# EAGLE design ts6907 (EAGLE 6.6.0)

## Sheet 1 of 2
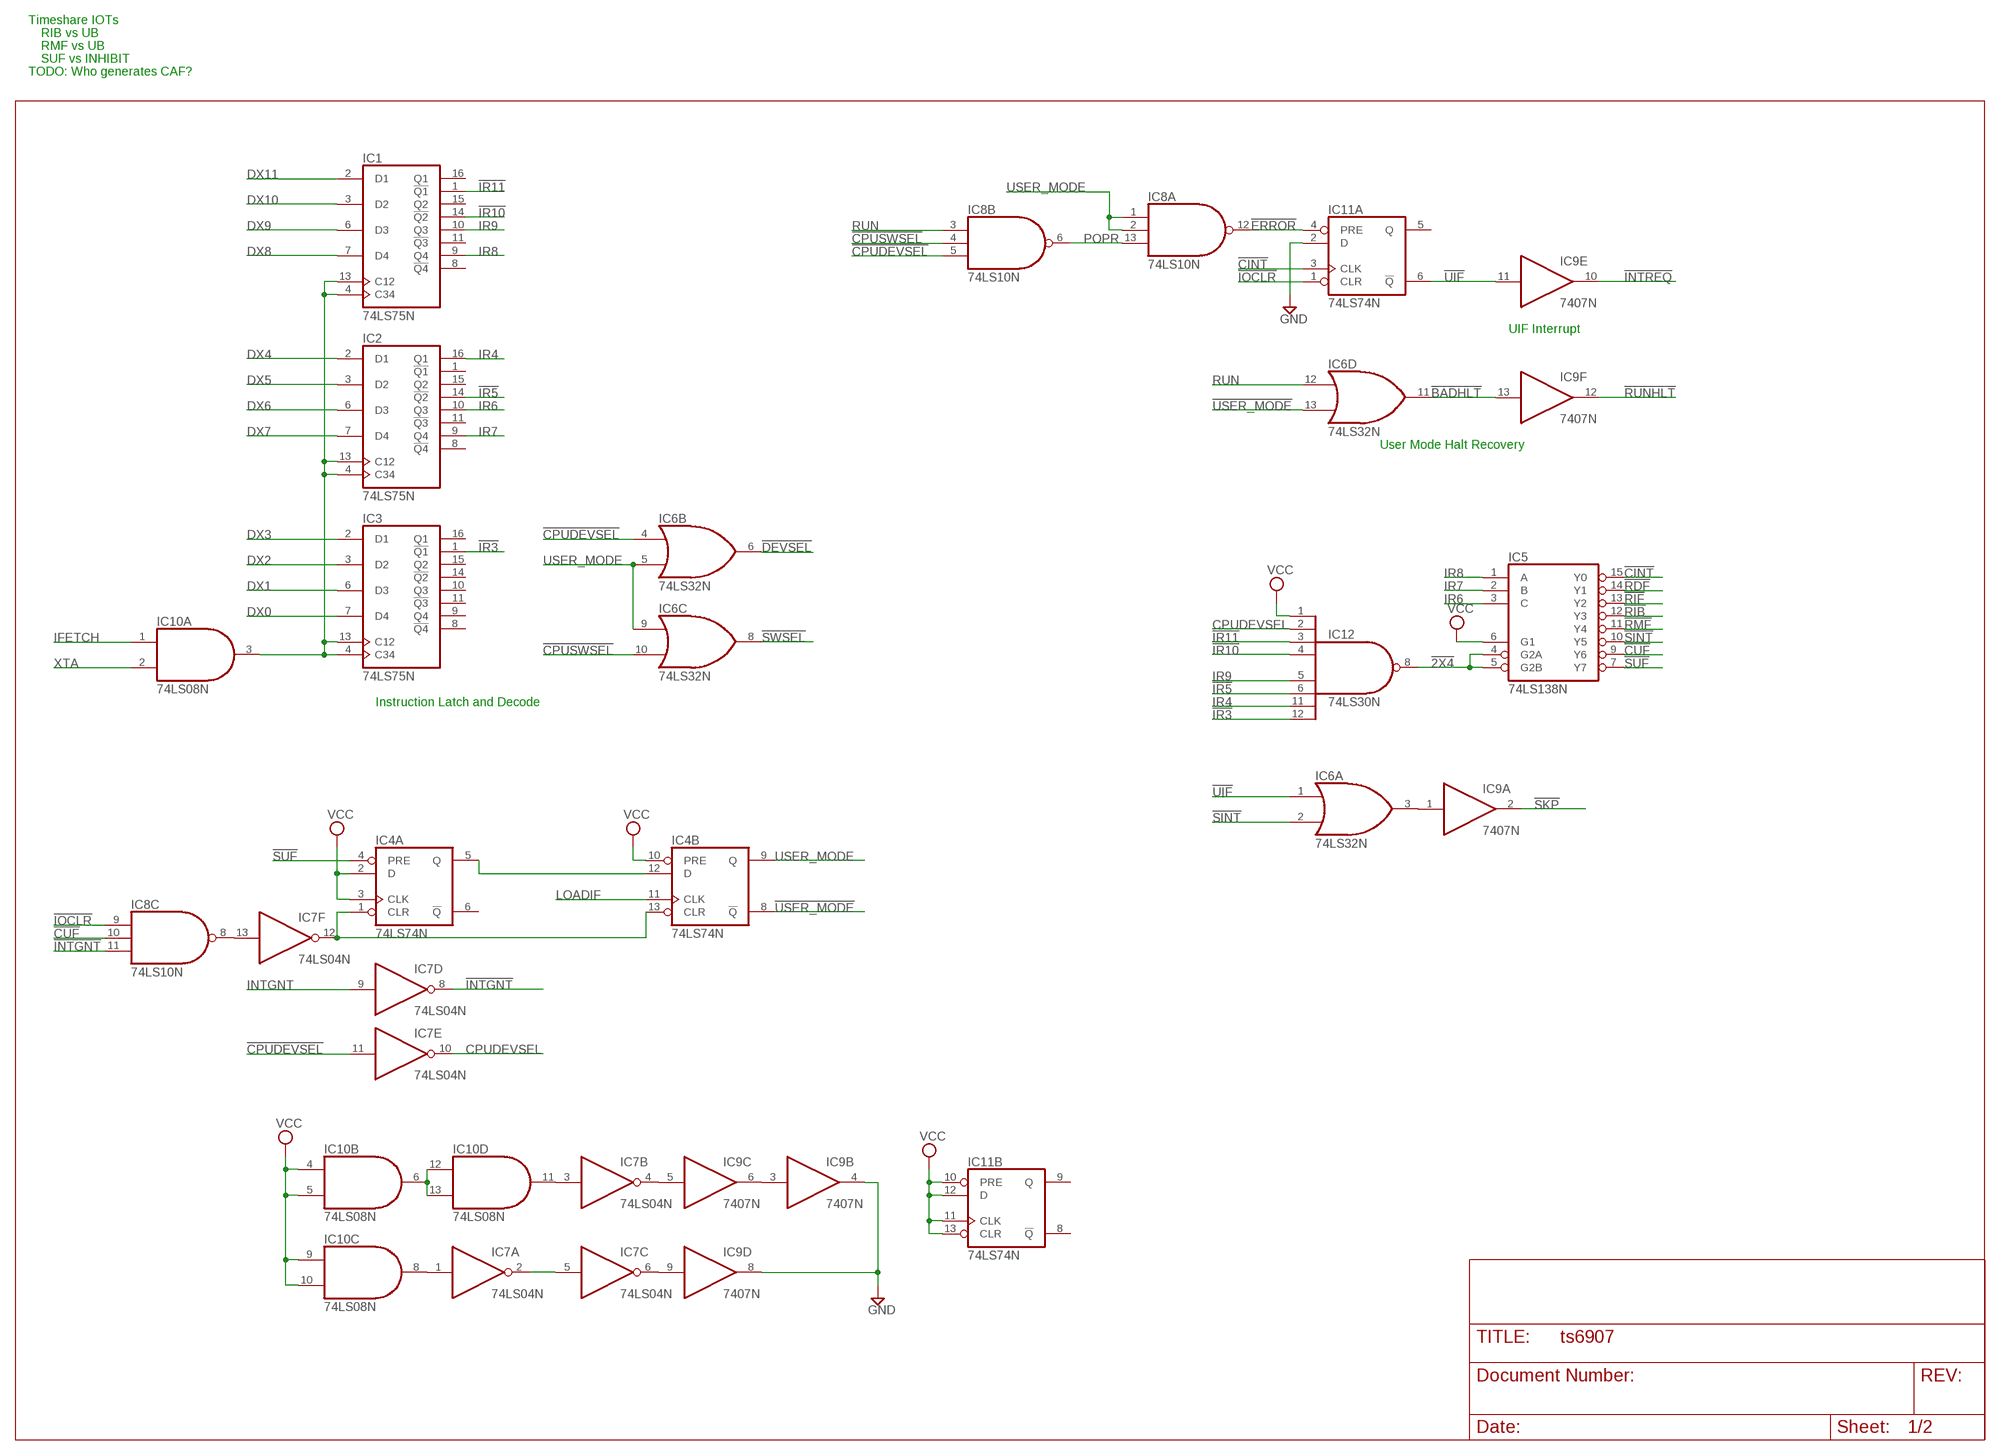
[diagram p0: schematic, sheet 1]

### Parts
IC1  74LS75N  [DIL16]
IC2  74LS75N  [DIL16]
IC3  74LS75N  [DIL16]
IC4  74LS74N  [DIL14]
IC5  74LS138N  [DIL16]
IC6  74LS32N  [DIL14]
IC7  74LS04N  [DIL14]
IC8  74LS10N  [DIL14]
IC9  7407N  [DIL14]
IC10  74LS08N  [DIL14]
IC11  74LS74N  [DIL14]
IC12  74LS30N  [DIL14]

### Nets
!2X4: IC5.4(G2A) IC5.5(G2B) IC12.8(O)
!BADHLT: IC6.11(D:O) IC9.13(F:I)
!CINT: IC5.15(Y0) IC11.3(A:CLK)
!CPUDEVSEL: IC6.4(B:I0) IC7.11(E:I) IC8.5(B:I2) ; also sheet 2
!CPUSWSEL: IC6.10(C:I1) IC8.4(B:I1) ; also sheet 2
!CUF: IC5.9(Y6) IC8.10(C:I1)
!DEVSEL: IC6.6(B:O) ; also sheet 2
!ERROR: IC8.12(A:O) IC11.4(A:PRE)
!INTGNT: IC7.8(D:O) IC8.11(C:I2)
!INTREQ: IC9.10(E:O) ; also sheet 2
!IOCLR: IC8.9(C:I0) IC11.1(A:CLR) ; also sheet 2
!IR3: IC3.1(!Q1) IC12.12(I7)
!IR5: IC2.14(!Q2) IC12.6(I5)
!IR10: IC1.14(!Q2) IC12.4(I3)
!IR11: IC1.1(!Q1) IC12.3(I2)
!RDF: IC5.14(Y1)
!RIB: IC5.12(Y3)
!RIF: IC5.13(Y2)
!RMF: IC5.11(Y4)
!RUNHLT: IC9.12(F:O) ; also sheet 2
!SINT: IC5.10(Y5) IC6.2(A:I1)
!SKP: IC9.2(A:O) ; also sheet 2
!SUF: IC4.4(A:PRE) IC5.7(Y7)
!SWSEL: IC6.8(C:O) ; also sheet 2
!UIF: IC6.1(A:I0) IC9.11(E:I) IC11.6(A:!Q)
!USER_MODE: IC4.8(B:!Q) IC6.13(D:I1)
CPUDEVSEL: IC7.10(E:O) IC12.2(I1)
DX0: IC3.7(D4) ; also sheet 2
DX1: IC3.6(D3) ; also sheet 2
DX2: IC3.3(D2) ; also sheet 2
DX3: IC3.2(D1) ; also sheet 2
DX4: IC2.2(D1) ; also sheet 2
DX5: IC2.3(D2) ; also sheet 2
DX6: IC2.6(D3) ; also sheet 2
DX7: IC2.7(D4) ; also sheet 2
DX8: IC1.7(D4) ; also sheet 2
DX9: IC1.6(D3) ; also sheet 2
DX10: IC1.3(D2) ; also sheet 2
DX11: IC1.2(D1) ; also sheet 2
GND: IC9.4(B:O) IC9.8(D:O) IC11.2(A:D) ; also sheet 2
IFETCH: IC10.1(A:I0) ; also sheet 2
INTGNT: IC7.9(D:I) ; also sheet 2
IR4: IC2.16(Q1) IC12.11(I6)
IR6: IC2.10(Q3) IC5.3(C)
IR7: IC2.9(Q4) IC5.2(B)
IR8: IC1.9(Q4) IC5.1(A)
IR9: IC1.10(Q3) IC12.5(I4)
LOADIF: IC4.11(B:CLK) ; also sheet 2
N$1: IC4.5(A:Q) IC4.12(B:D)
N$2: IC7.1(A:I) IC10.8(C:O)
N$3: IC1.4(C34) IC1.13(C12) IC2.4(C34) IC2.13(C12) IC3.4(C34) IC3.13(C12) IC10.3(A:O)
N$4: IC4.1(A:CLR) IC4.13(B:CLR) IC7.12(F:O)
N$5: IC7.3(B:I) IC10.11(D:O)
N$6: IC7.2(A:O) IC7.5(C:I)
N$7: IC10.6(B:O) IC10.12(D:I0) IC10.13(D:I1)
N$8: IC7.4(B:O) IC9.5(C:I)
N$9: IC7.6(C:O) IC9.9(D:I)
N$10: IC9.3(B:I) IC9.6(C:O)
N$11: IC6.3(A:O) IC9.1(A:I)
N$12: IC7.13(F:I) IC8.8(C:O)
POPR: IC8.6(B:O) IC8.13(A:I2)
RUN: IC6.12(D:I0) IC8.3(B:I0) ; also sheet 2
USER_MODE: IC4.9(B:Q) IC6.5(B:I1) IC6.9(C:I0) IC8.1(A:I0) IC8.2(A:I1)
VCC: IC4.2(A:D) IC4.3(A:CLK) IC4.10(B:PRE) IC5.6(G1) IC10.4(B:I0) IC10.5(B:I1) IC10.9(C:I0) IC10.10(C:I1) IC11.10(B:PRE) IC11.11(B:CLK) IC11.12(B:D) IC11.13(B:CLR) IC12.1(I0) ; also sheet 2
XTA: IC10.2(A:I1) ; also sheet 2
Unconnected: IC1.8(!Q4) IC1.11(!Q3) IC1.15(Q2) IC1.16(Q1) IC2.1(!Q1) IC2.8(!Q4) IC2.11(!Q3) IC2.15(Q2) IC3.8(!Q4) IC3.9(Q4) IC3.10(Q3) IC3.11(!Q3) IC3.14(!Q2) IC3.15(Q2) IC3.16(Q1) IC4.6(A:!Q) IC11.5(A:Q) IC11.8(B:!Q) IC11.9(B:Q)

### Notes on the sheet
- Timeshare IOTs
- RIB vs UB
- RMF vs UB
- SUF vs INHIBIT
- TODO: Who generates CAF?
- UIF Interrupt
- User Mode Halt Recovery
- Instruction Latch and Decode

## Sheet 2 of 2
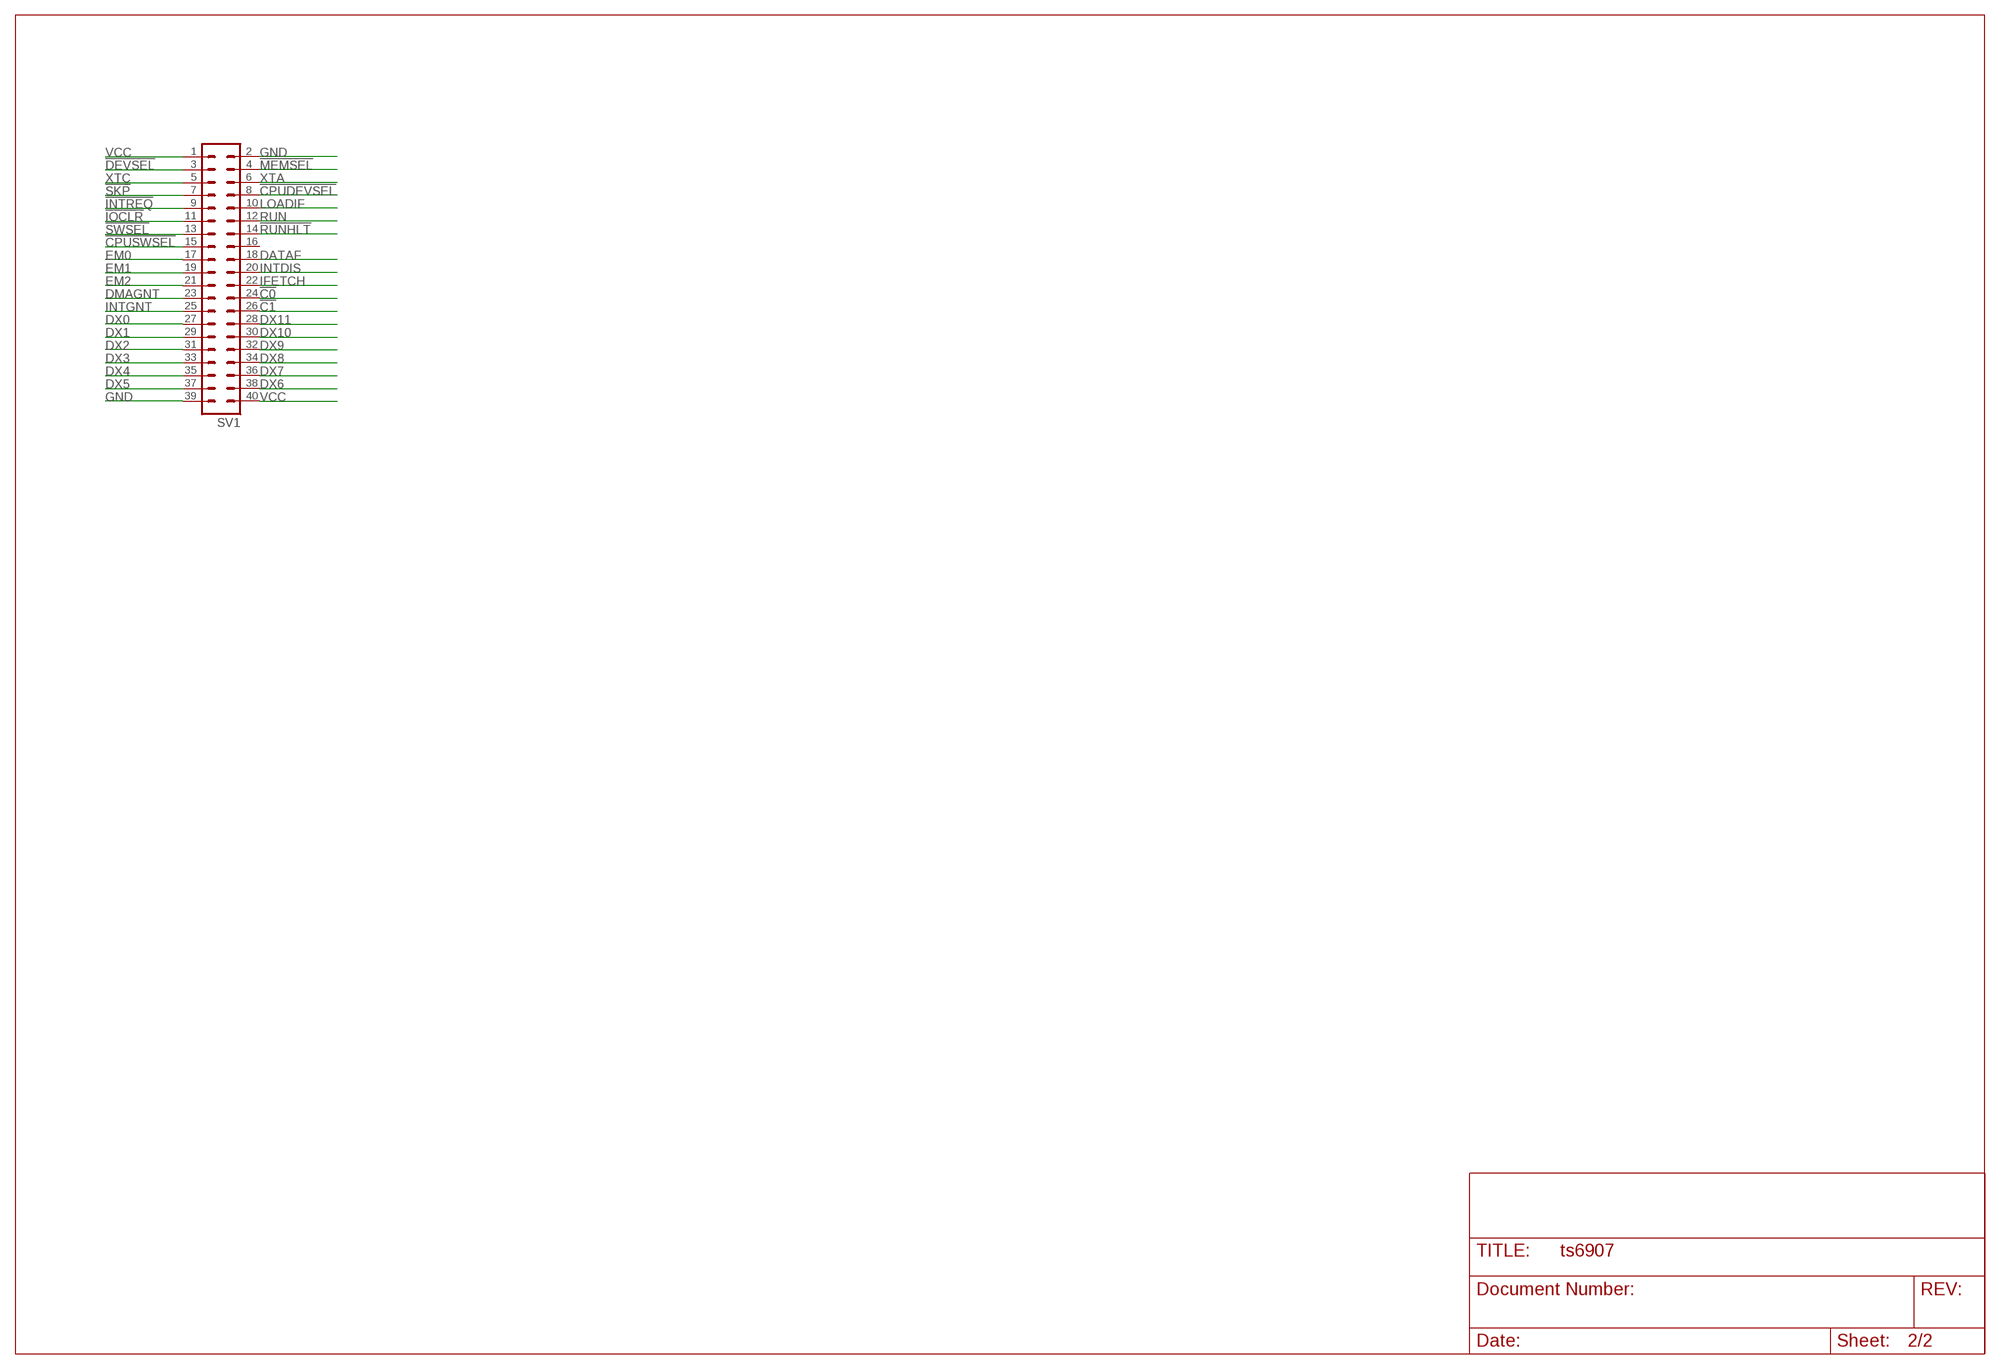
[diagram p1: schematic, sheet 2]

### Parts
SV1  MA20-2  [MA20-2]

### Nets
!C0: SV1.24
!C1: SV1.26
!CPUDEVSEL: SV1.8 ; also sheet 1
!CPUSWSEL: SV1.15 ; also sheet 1
!DEVSEL: SV1.3 ; also sheet 1
!INTREQ: SV1.9 ; also sheet 1
!IOCLR: SV1.11 ; also sheet 1
!MEMSEL: SV1.4
!RUNHLT: SV1.14 ; also sheet 1
!SKP: SV1.7 ; also sheet 1
!SWSEL: SV1.13 ; also sheet 1
DATAF: SV1.18
DMAGNT: SV1.23
DX0: SV1.27 ; also sheet 1
DX1: SV1.29 ; also sheet 1
DX2: SV1.31 ; also sheet 1
DX3: SV1.33 ; also sheet 1
DX4: SV1.35 ; also sheet 1
DX5: SV1.37 ; also sheet 1
DX6: SV1.38 ; also sheet 1
DX7: SV1.36 ; also sheet 1
DX8: SV1.34 ; also sheet 1
DX9: SV1.32 ; also sheet 1
DX10: SV1.30 ; also sheet 1
DX11: SV1.28 ; also sheet 1
EM0: SV1.17
EM1: SV1.19
EM2: SV1.21
GND: SV1.2 SV1.39 ; also sheet 1
IFETCH: SV1.22 ; also sheet 1
INTDIS: SV1.20
INTGNT: SV1.25 ; also sheet 1
LOADIF: SV1.10 ; also sheet 1
RUN: SV1.12 ; also sheet 1
VCC: SV1.1 SV1.40 ; also sheet 1
XTA: SV1.6 ; also sheet 1
XTC: SV1.5
Unconnected: SV1.16

## Power pins joined to a net without a drawn wire
GND: IC1.12(GND) IC2.12(GND) IC3.12(GND) IC4.7(P:GND) IC5.8(GND) IC6.7(P:GND) IC7.7(P:GND) IC8.7(P:GND) IC9.7(P:GND) IC10.7(P:GND) IC11.7(P:GND) IC12.7(GND)
VCC: IC1.5(VCC) IC2.5(VCC) IC3.5(VCC) IC4.14(P:VCC) IC5.16(VCC) IC6.14(P:VCC) IC7.14(P:VCC) IC8.14(P:VCC) IC9.14(P:VCC) IC10.14(P:VCC) IC11.14(P:VCC) IC12.14(VCC)

## Library data of the parts
IC1-IC3 = 74xx-us:74*75: 4-bit bistable LATCH
IC4 IC11 = 74xx-us:74*74: Dual D type positive edge triggered FLIP FLOP, preset and clear
IC5 = 74xx-us:74*138: 3-line to 8-line DECODER/DEMULTIPLEXER
IC6 = 74xx-us:74*32: Quad 2-input OR gate
IC7 = 74xx-us:74*04: Hex INVERTER
IC8 = 74xx-us:74*10: Triple 3-input NAND gate
IC9 = 74xx-us:74*07: Hex BUFFER, open collector high-voltage output
IC10 = 74xx-us:74*08: Quad 2-input AND gate
IC12 = 74xx-us:74*30: 8-input NAND gate
SV1 = con-lstb:MA20-2: PIN HEADER; OC_FARNELL: unknown; OC_NEWARK: unknown

## Board
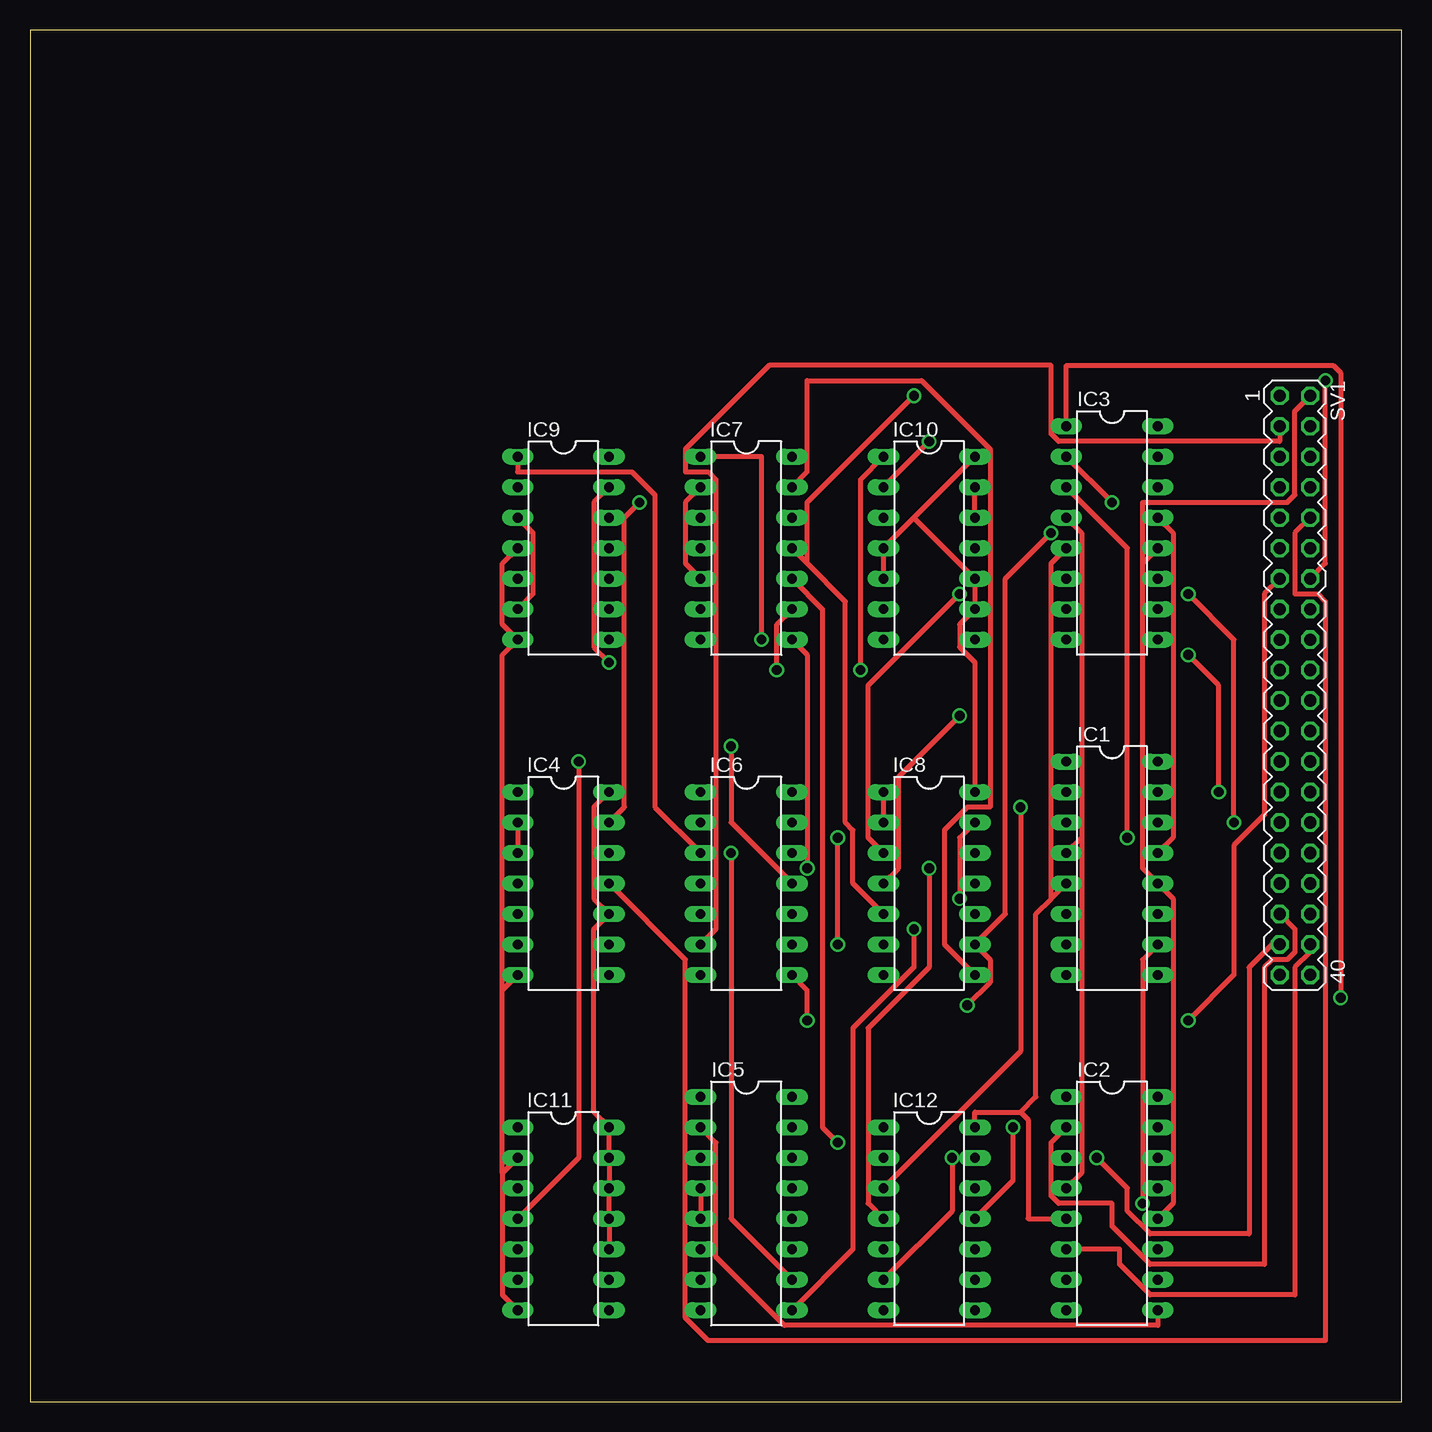
[diagram p2: board, top side]
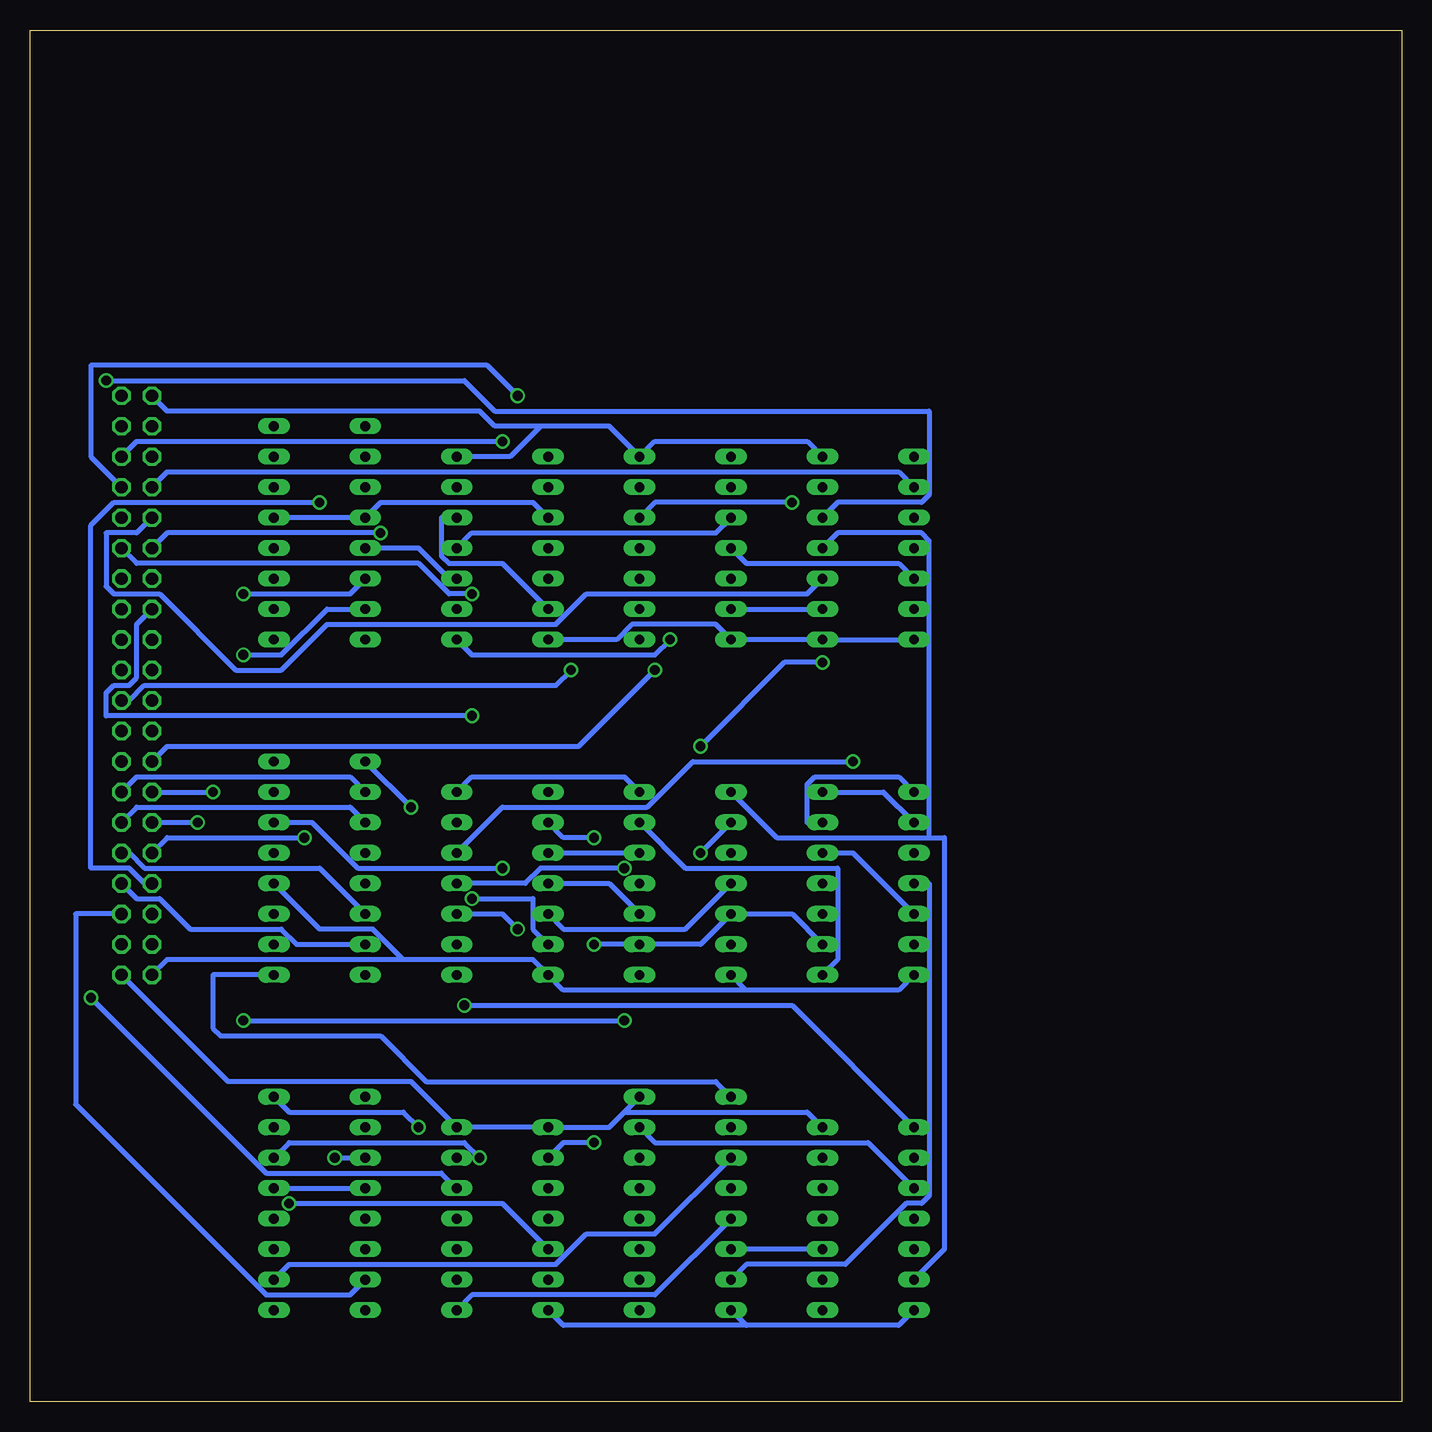
[diagram p3: board, bottom side, seen from below]

Size 114.3 x 114.3 mm. Coordinates in mm from the lower left corner, seen from the top.
Outline: 0,0 114.3,0 114.3,114.3 0,114.3 0,0
Copper layers (1+16): Top 0.035mm / dielectric 1.5mm / Bottom 0.035mm
Design rules "16mils": minimum track width 16mil, minimum drill 32mil, track to track 15mil, track to pad 10mil, pad to pad 10mil, via to via 10mil, smd to smd 10mil, copper to edge 13mil, drill to drill 10mil, minimum pad ring 10mil, minimum via ring 8mil, stop-mask expansion 0mil, vias tented up to drill 0mil, thermal gap 10mil

### Footprints (pad centres in the part's own frame; a part is rotated, then mirrored left to right if it is on the bottom)
DIL16 = drill 0.813 long: 1 -8.89,-3.81; 2 -6.35,-3.81; 3 -3.81,-3.81; 4 -1.27,-3.81; 5 1.27,-3.81; 6 3.81,-3.81; 7 6.35,-3.81; 8 8.89,-3.81; 9 8.89,3.81; 10 6.35,3.81; 11 3.81,3.81; 12 1.27,3.81; 13 -1.27,3.81; 14 -3.81,3.81; 15 -6.35,3.81; 16 -8.89,3.81
DIL14 = drill 0.813 long: 1 -7.62,-3.81; 2 -5.08,-3.81; 3 -2.54,-3.81; 4 0,-3.81; 5 2.54,-3.81; 6 5.08,-3.81; 7 7.62,-3.81; 8 7.62,3.81; 9 5.08,3.81; 10 2.54,3.81; 11 0,3.81; 12 -2.54,3.81; 13 -5.08,3.81; 14 -7.62,3.81
MA20-2 = drill 1.016 octagon: 1 -24.13,-1.27; 2 -24.13,1.27; 3 -21.59,-1.27; 4 -21.59,1.27; 5 -19.05,-1.27; 6 -19.05,1.27; 7 -16.51,-1.27; 8 -16.51,1.27; 9 -13.97,-1.27; 10 -13.97,1.27; 11 -11.43,-1.27; 12 -11.43,1.27; 13 -8.89,-1.27; 14 -8.89,1.27; 15 -6.35,-1.27; 16 -6.35,1.27; 17 -3.81,-1.27; 18 -3.81,1.27; 19 -1.27,-1.27; 20 -1.27,1.27; 21 1.27,-1.27; 22 1.27,1.27; 23 3.81,-1.27; 24 3.81,1.27; 25 6.35,-1.27; 26 6.35,1.27; 27 8.89,-1.27; 28 8.89,1.27; 29 11.43,-1.27; 30 11.43,1.27; 31 13.97,-1.27; 32 13.97,1.27; 33 16.51,-1.27; 34 16.51,1.27; 35 19.05,-1.27; 36 19.05,1.27; 37 21.59,-1.27; 38 21.59,1.27; 39 24.13,-1.27; 40 24.13,1.27

### Placement (x,y rotation side)
IC1  90.17,44.45 270 top
IC2  90.17,16.51 270 top
IC3  90.17,72.39 270 top
IC4  44.45,43.18 270 top
IC5  59.69,16.51 270 top
IC6  59.69,43.18 270 top
IC7  59.69,71.12 270 top
IC8  74.93,43.18 270 top
IC9  44.45,71.12 270 top
IC10  74.93,71.12 270 top
IC11  44.45,15.24 270 top
IC12  74.93,15.24 270 top
SV1  105.41,59.69 270 top

### Tracks (layer width: path | path; a pad name or v marks a point on that pad's centre or on a via)
!2X4
  Top 0.406: IC5.4 IC5.5
  Bottom 0.406: IC12.8 77.47,8.89 62.23,8.89 IC5.5
!BADHLT  (via drill 0.81)
  Top 0.406: IC6.11 58.42,48.26 v58.42,54.61 | v48.26,61.59 46.99,62.87 46.99,74.93 IC9.13
  Bottom 0.406: v58.42,54.61 51.44,61.59 v48.26,61.59
!CINT
  Bottom 0.406: IC11.3 44.45,21.59 62.23,21.59 IC5.15
!CPUDEVSEL  (via drill 0.81)
  Top 0.406: 64.77,69.85 67.94,66.67 67.94,48.26 68.58,47.62 68.58,43.18 IC8.5 | 64.77,69.85 IC7.11 | v73.66,83.82 64.77,74.93 64.77,69.85
  Bottom 0.406: IC6.4 59.69,39.37 69.85,39.37 IC8.5 | SV1.8 109.22,78.74 109.22,86.36 76.2,86.36 v73.66,83.82
!CPUSWSEL  (via drill 0.81)
  Top 0.406: v77.47,57.15 72.39,52.07 72.39,44.45 IC8.4
  Bottom 0.406: IC6.10 66.04,43.18 IC8.4 | SV1.15 105.41,64.77 105.41,60.33 106.05,59.69 107.31,59.69 107.95,59.05 107.95,57.15 v77.47,57.15
!CUF  (via drill 0.81)
  Top 0.406: IC5.9 68.58,12.7 68.58,31.11 73.66,36.2 v73.66,39.37
  Bottom 0.406: v73.66,39.37 74.93,40.64 IC8.10
!DEVSEL
  Top 0.406: IC6.6 57.15,39.37 57.15,76.83 56.52,77.47 54.61,77.47 54.61,79.38 61.59,86.36 85.09,86.36 85.09,80.64 85.72,80.01 104.14,80.01 SV1.3
!ERROR  (via drill 0.81)
  Top 0.406: IC11.4 45.72,20.32 v45.72,53.34
  Bottom 0.406: v45.72,53.34 59.05,53.34 62.87,49.53 74.93,49.53 IC8.12
!INTGNT  (via drill 0.81)
  Top 0.406: v64.77,44.45 64.77,62.23 IC7.8
  Bottom 0.406: IC8.11 73.03,43.18 71.75,44.45 v64.77,44.45
!INTREQ
  Bottom 0.406: IC9.10 49.53,67.31 67.94,67.31 70.48,64.77 89.53,64.77 93.34,60.96 97.16,60.96 103.5,67.31 107.31,67.31 107.95,67.94 107.95,72.39 105.41,72.39 SV1.9
!IOCLR  (via drill 0.81)
  Top 0.406: v78.11,33.02 80.01,34.92 80.01,36.83 IC8.9 81.28,40.64 81.28,68.58 v85.09,72.39
  Bottom 0.406: IC11.1 50.8,33.02 v78.11,33.02 | SV1.11 102.87,72.39 v85.09,72.39
!IR3  (via drill 0.81)
  Top 0.406: v109.22,33.66 109.22,85.72 108.58,86.36 86.36,86.36 IC3.1
  Bottom 0.406: IC12.12 80.01,19.05 94.61,19.05 v109.22,33.66
!IR5  (via drill 0.81)
  Top 0.406: IC12.6 76.83,15.88 v76.83,20.32
  Bottom 0.406: v76.83,20.32 78.11,21.59 92.71,21.59 IC2.14
!IR10  (via drill 0.81)
  Top 0.406: IC12.4 69.85,16.51 69.85,31.11 74.93,36.2 v74.93,44.45
  Bottom 0.406: v74.93,44.45 87,44.45 90.81,48.26 IC1.14
!IR11  (via drill 0.81)
  Top 0.406: IC12.3 82.55,29.21 v82.55,49.53
  Bottom 0.406: IC1.1 v82.55,49.53
!RUNHLT  (via drill 0.81)
  Top 0.406: v107.95,85.09 107.95,69.85 SV1.14
  Bottom 0.406: IC9.12 46.99,74.93 40.01,74.93 39.37,75.56 39.37,82.55 75.56,82.55 78.11,85.09 v107.95,85.09
!SINT  (via drill 0.81)
  Top 0.406: IC5.10 58.42,15.24 v58.42,45.72
  Bottom 0.406: IC6.2 v58.42,45.72
!SKP
  Bottom 0.406: IC9.2 41.91,77.47 102.87,77.47 SV1.7
!SUF
  Bottom 0.406: IC5.7 54.61,11.43 46.35,11.43 41.27,16.51 40.01,16.51 39.37,17.14 39.37,43.18 IC4.4
!SWSEL  (via drill 0.81)
  Top 0.406: IC6.8 64.77,34.29 v64.77,31.75 | v96.52,31.75 100.33,35.56 100.33,46.35 102.87,48.9 102.87,67.31 SV1.13
  Bottom 0.406: v96.52,31.75 v64.77,31.75
!UIF
  Bottom 0.406: IC11.6 38.1,12.7 38.1,46.99 39.37,46.99 | 39.37,46.99 52.07,46.99 IC6.1 | IC9.11 46.99,72.39 40.01,72.39 39.37,71.75 39.37,46.99
!USER_MODE
  Bottom 0.406: IC4.8 46.99,36.83 46.99,44.45 59.69,44.45 IC6.13
CPUDEVSEL  (via drill 0.81)
  Top 0.406: v67.31,21.59 66.04,22.86 66.04,66.04 IC7.10
  Bottom 0.406: IC12.2 69.85,21.59 v67.31,21.59
DX0  (via drill 0.81)
  Top 0.406: v96.52,62.23 99.06,59.69 v99.06,50.8
  Bottom 0.406: IC3.7 89.53,66.04 93.34,62.23 v96.52,62.23 | SV1.27 v99.06,50.8
DX1  (via drill 0.81)
  Top 0.406: v96.52,67.31 100.33,63.5 v100.33,48.26
  Bottom 0.406: IC3.6 87.63,67.31 v96.52,67.31 | SV1.29 v100.33,48.26
DX2  (via drill 0.81)
  Top 0.406: IC3.3 91.44,71.12 v91.44,46.99
  Bottom 0.406: v91.44,46.99 102.87,46.99 SV1.31
DX3  (via drill 0.81)
  Top 0.406: v90.17,74.93 IC3.2
  Bottom 0.406: v90.17,74.93 107.31,74.93 109.22,73.03 109.22,44.45 106.05,44.45 104.78,43.18 SV1.33
DX4
  Top 0.406: IC2.2 85.09,21.59 85.09,17.14 85.72,16.51 90.17,16.51 90.17,14.61 93.34,11.43 102.87,11.43 102.87,36.2 103.5,36.83 104.78,36.83 105.41,37.47 105.41,39.37 SV1.35
DX5  (via drill 0.81)
  Top 0.406: v88.9,20.32 91.44,17.78 91.44,15.88 93.34,13.97 101.6,13.97 101.6,36.2 103.5,38.1 SV1.37
  Bottom 0.406: v88.9,20.32 IC2.3
DX6
  Top 0.406: IC2.6 90.81,12.7 90.81,11.43 93.34,8.89 105.41,8.89 105.41,36.2 106.68,37.47 SV1.38
DX7
  Bottom 0.406: IC2.7 87.63,8.89 94.61,8.89 110.49,24.77 110.49,40.64 SV1.36
DX8
  Bottom 0.406: IC1.7 92.08,38.1 93.34,39.37 100.97,39.37 103.5,41.91 105.41,41.91 SV1.34
DX9
  Bottom 0.406: IC1.6 90.17,44.45 104.78,44.45 106.05,45.72 SV1.32
DX10
  Bottom 0.406: IC1.3 87.63,49.53 105.41,49.53 SV1.30
DX11
  Bottom 0.406: IC1.2 87.63,52.07 105.41,52.07 SV1.28
GND
  Top 0.406: IC2.12 95.25,16.51 95.25,41.91 IC1.12 92.71,44.45 92.71,69.85 | 92.71,69.85 IC3.12 | SV1.2 105.41,82.55 105.41,75.56 104.78,74.93 92.71,74.93 92.71,69.85 | IC9.4 39.37,69.85 39.37,64.77 IC9.7 39.37,62.23 39.37,34.29 | IC11.7 39.37,8.89 39.37,19.05 | IC11.2 39.37,19.05 | 39.37,34.29 IC4.7 | 39.37,19.05 39.37,34.29
  Bottom 0.406: IC9.7 IC9.8 IC7.7 57.15,64.77 64.14,64.77 65.41,63.5 IC10.7 | 54.61,6.35 IC5.8 | 54.61,6.35 41.91,6.35 IC11.7 | 54.61,34.29 IC6.7 | 54.61,34.29 41.91,34.29 IC4.7 | IC12.7 69.85,6.35 54.61,6.35 | 54.61,34.29 69.85,34.29 IC8.7 72.39,36.83 83.19,36.83 | SV1.39 102.87,36.83 83.19,36.83 | IC1.12 90.17,39.37 85.72,39.37 83.19,36.83
IFETCH  (via drill 0.81)
  Top 0.406: IC10.1 69.22,76.83 v69.22,60.96
  Bottom 0.406: v69.22,60.96 70.48,59.69 104.78,59.69 106.05,58.42 SV1.22
INTGNT  (via drill 0.81)
  Top 0.406: IC7.9 62.23,64.77 v62.23,60.96
  Bottom 0.406: v62.23,60.96 68.58,54.61 102.87,54.61 SV1.25
IR4  (via drill 0.81)
  Top 0.406: IC12.11 81.92,18.41 v81.92,22.86
  Bottom 0.406: v81.92,22.86 83.19,24.13 92.71,24.13 IC2.16
IR6
  Bottom 0.406: IC5.3 62.23,13.97 67.94,13.97 70.48,11.43 92.71,11.43 IC2.10
IR7
  Top 0.406: IC5.2 57.15,21.59 57.15,12.06 62.87,6.35 93.98,6.35 IC2.9
IR8
  Bottom 0.406: IC5.1 57.15,26.67 81.28,26.67 85.09,30.48 98.42,30.48 99.06,31.11 99.06,35.56 IC1.9
IR9  (via drill 0.81)
  Top 0.406: v92.71,16.51 92.71,36.83 IC1.10
  Bottom 0.406: IC12.5 74.93,16.51 v92.71,16.51
LOADIF
  Top 0.406: IC4.11 54.61,36.83 54.61,6.99 56.52,5.08 107.95,5.08 107.95,66.67 107.31,67.31 105.41,67.31 105.41,72.39 SV1.10
N$1
  Bottom 0.406: IC4.5 45.72,45.72 IC4.12
N$2  (via drill 0.81)
  Top 0.406: IC7.1 60.96,78.74 v60.96,63.5
  Bottom 0.406: v60.96,63.5 62.23,62.23 77.47,62.23 IC10.8
N$3
  Top 0.406: IC1.13 95.25,46.99 95.25,72.39 IC3.13 | 87.63,46.99 IC1.4 | 87.63,46.99 87.63,72.39 IC3.4 | IC2.4 87.63,19.05 87.63,46.99
  Bottom 0.406: IC2.13 IC2.4 | IC10.3 72.39,74.93 85.09,74.93 IC3.4 IC3.13
N$4  (via drill 0.81)
  Top 0.406: v50.8,74.93 49.53,73.66 49.53,49.53 IC4.13
  Bottom 0.406: IC4.1 41.91,52.07 48.9,52.07 49.53,51.44 49.53,48.26 IC4.13 | IC7.12 62.23,74.93 v50.8,74.93
N$5
  Bottom 0.406: IC7.3 57.15,72.39 77.47,72.39 IC10.11
N$6
  Top 0.406: IC7.5 54.61,69.85 54.61,74.93 IC7.2
N$7
  Top 0.406: IC10.12 IC10.13
  Bottom 0.406: IC10.6 74.93,69.85 79.38,69.85 80.01,70.48 80.01,73.66 IC10.12
N$8
  Bottom 0.406: IC9.5 41.91,69.85 54.61,69.85 IC7.4
N$9
  Bottom 0.406: IC7.6 IC9.9
N$10
  Top 0.406: IC9.6 41.91,67.31 41.91,72.39 IC9.3
N$11
  Top 0.406: IC6.3 52.07,49.53 52.07,75.56 50.16,77.47 40.64,77.47 IC9.1
N$12
  Top 0.406: IC8.8 76.2,38.1 76.2,47.62 78.11,49.53 80.01,49.53 80.01,79.38 74.3,85.09 64.77,85.09 64.77,77.47 IC7.13
POPR  (via drill 0.81)
  Top 0.406: v77.47,41.91 77.47,46.99 IC8.13
  Bottom 0.406: IC8.6 72.39,39.37 72.39,41.91 v77.47,41.91
RUN  (via drill 0.81)
  Top 0.406: v77.47,67.31 69.85,59.69 69.85,46.99 IC8.3
  Bottom 0.406: IC8.3 IC6.12 | SV1.12 105.41,69.85 81.92,69.85 79.38,67.31 v77.47,67.31
USER_MODE  (via drill 0.81)
  Top 0.406: IC8.1 IC8.2 | v67.31,38.1 v67.31,46.99
  Bottom 0.406: IC4.9 50.8,40.64 IC6.5 58.42,38.1 IC6.9 v67.31,38.1 | IC8.2 69.85,46.99 v67.31,46.99
VCC
  Top 0.406: IC10.5 IC10.4 73.66,73.66 | 73.66,73.66 IC10.14 | 73.66,73.66 IC10.10 IC10.9 77.47,64.77 77.47,62.87 78.74,61.59 IC8.14 | IC4.2 IC4.3 | IC4.14 46.99,49.53 46.99,41.91 IC4.10 46.99,39.37 46.99,24.13 IC11.14 IC11.13 IC11.12 IC11.11 IC11.10 | IC2.5 83.19,15.24 83.19,23.5 82.55,24.13 | 82.55,24.13 78.74,24.13 IC12.14 | 85.09,41.91 83.82,40.64 83.82,25.4 82.55,24.13 | 85.09,41.91 IC1.5 | IC3.5 85.09,69.85 85.09,41.91
  Bottom 0.406: IC6.14 64.77,52.07 77.47,52.07 IC8.14 | IC3.5 81.92,71.12 79.38,68.58 IC10.10 | IC9.14 49.53,80.01 62.23,80.01 IC7.14 66.04,81.28 71.75,81.28 | SV1.1 102.87,82.55 76.83,82.55 75.56,81.28 71.75,81.28 | IC10.14 74.3,78.74 71.75,81.28 | IC4.2 43.18,50.8 IC4.14 | IC11.10 IC5.6 | 64.77,24.13 66.04,22.86 IC12.1 IC12.14 82.55,26.67 97.79,26.67 SV1.40 | 64.77,24.13 IC5.16 | IC11.14 49.53,24.13 64.77,24.13
XTA  (via drill 0.81)
  Top 0.406: v74.93,80.01 IC10.2
  Bottom 0.406: v74.93,80.01 105.41,80.01 SV1.6